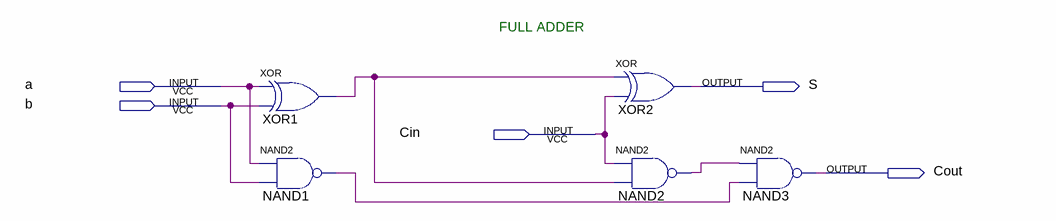
[diagram p0: schematic sheet]
// Quartus schematic FullAdder.bdf as structural Verilog: 5 symbols, 5 pins
module FullAdder (
  input  a,
  input  b,
  input  Cin,
  output S,
  output Cout
);

  wire NAND1_out, NAND2_out, XOR1_out;

  xor XOR1 (XOR1_out, a, b);
  nand NAND1 (NAND1_out, a, b);
  xor XOR2 (S, XOR1_out, Cin);
  nand NAND2 (NAND2_out, Cin, XOR1_out);
  nand NAND3 (Cout, NAND2_out, NAND1_out);

  // Notes on the sheet:
  //   FULL ADDER
endmodule
